# Altium schematic sheet Memory.SchDoc
size A; DrawnBy: TIMKEN; SheetNumber: 6; SheetTotal: 7
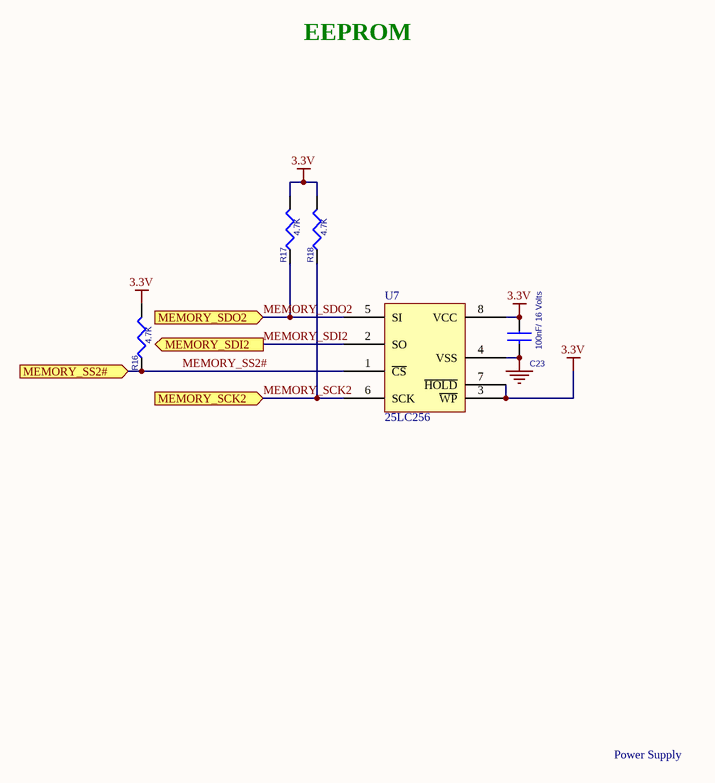
[diagram p0: Memory.SchDoc]

## Parts
C23  100nF/ 16 Volts  [CAP_CERAMIC]
R16  4.7K  [RES_SMD]
R17  4.7K  [RES_SMD]
R18  4.7K  [RES_SMD]
U7  25LC256  [25LC256]

## Ports
MEMORY_SCK2 (in), MEMORY_SDI2 (out), MEMORY_SDO2 (in), MEMORY_SS2# (in)

## Nets
3.3V: C23.1 R16.2 R17.2 R18.2 U7.3(~{WP}) U7.7(~{HOLD}) U7.8(VCC)
GND_POWER: C23.2 U7.4(VSS)
MEMORY_SCK2: R18.1 U7.6(SCK) ; port MEMORY_SCK2
MEMORY_SDI2: U7.2(SO) ; port MEMORY_SDI2
MEMORY_SDO2: R17.1 U7.5(SI) ; port MEMORY_SDO2
MEMORY_SS2#: R16.1 U7.1(~{CS}) ; port MEMORY_SS2#

## Notes on the sheet
- EEPROM
- Power Supply

## Library data of the parts
C23 = CAP NP: V P No: 644160RL; Vendor: Farnell; M P No: CC0805KRX7R7BB104; Descr: CAPACITOR, 0805, 100NF, 16V, X7R; FootPrint: C0805
R16-R18 = RESISTOR: Vendor: Digikey; Descr: RES 10K OHM 1/2W 5% 0805 SMD; V P No: P10KADTR-ND; M P No: ERJ-P06J103V; FootPrint: 0.079" L x 0.049" W (2.00mm x 1.25mm)  (0805 (2012 Metric)  )
U7 = 25LC256: V P No: 25LC256-I/SN-ND; Vendor: Digikey; Descr: IC EEPROM 256KBIT 10MHZ 8SOIC; M P No: 25LC256-I/SN; 25LC256: *; FootPrint: 8-SOIC (0.154", 3.90mm Width); Price: 1.39000